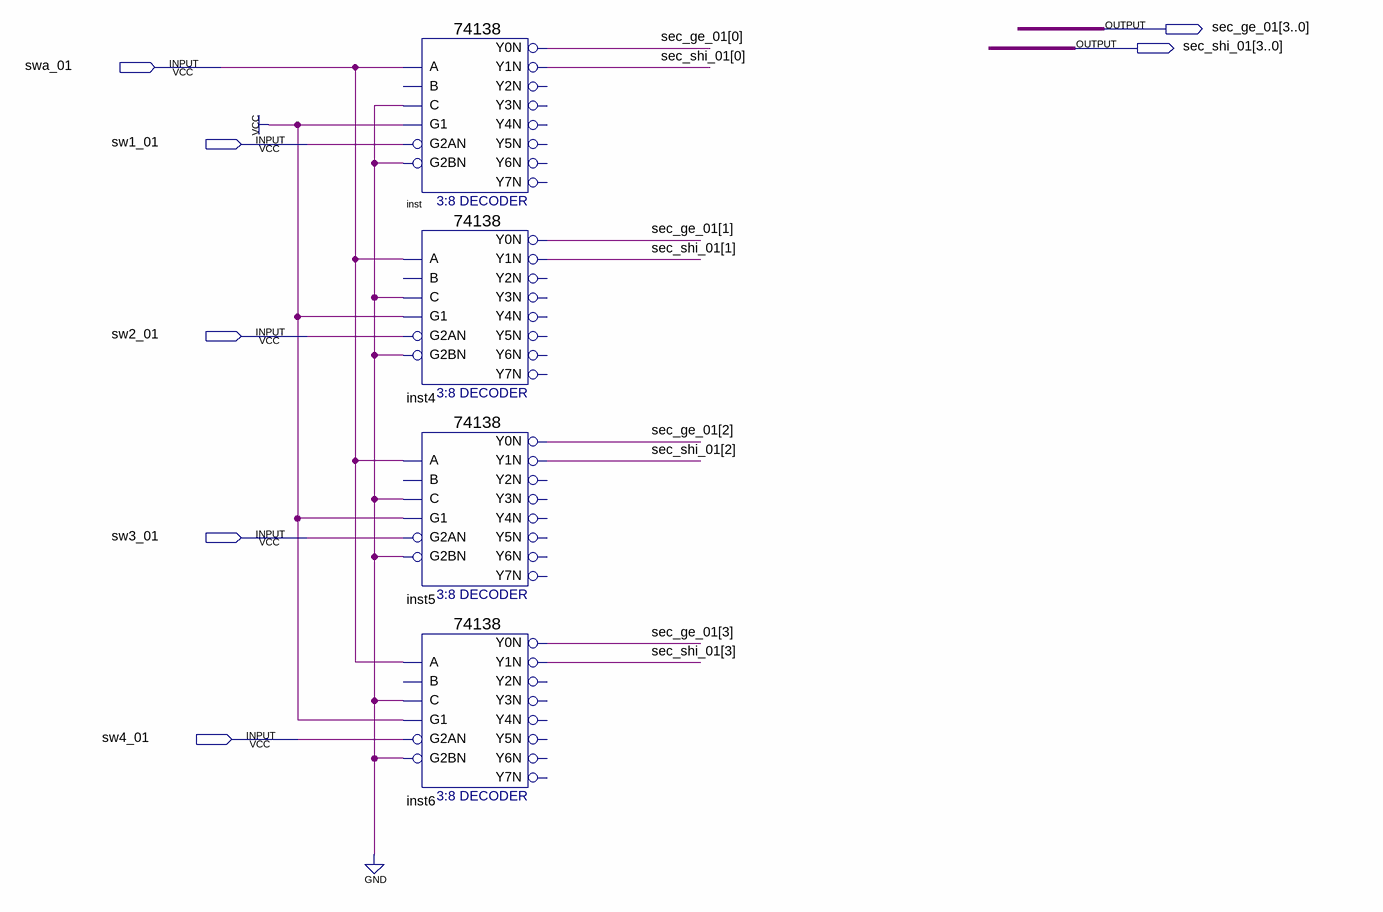
[diagram p0: schematic sheet]
// Quartus schematic fre_cin2.bdf as structural Verilog: 4 symbols, 7 pins
module fre_cin2 (
  input  swa_01,
  input  sw1_01,
  input  sw2_01,
  input  sw3_01,
  input  sw4_01,
  output [3:0] sec_ge_01,
  output [3:0] sec_shi_01
);

  \74138  inst (
    .A(swa_01), .G1(1'b1), .C(1'b0), .G2AN(sw1_01), .G2BN(1'b0), .Y0N(sec_ge_01[0]), .Y1N(sec_shi_01[0]));  // open: B, Y2N, Y3N, Y4N, Y5N, Y6N, Y7N
  \74138  inst4 (
    .A(swa_01), .G1(1'b1), .C(1'b0), .G2AN(sw2_01), .G2BN(1'b0), .Y0N(sec_ge_01[1]), .Y1N(sec_shi_01[1]));  // open: B, Y2N, Y3N, Y4N, Y5N, Y6N, Y7N
  \74138  inst5 (
    .A(swa_01), .G1(1'b1), .C(1'b0), .G2AN(sw3_01), .G2BN(1'b0), .Y0N(sec_ge_01[2]), .Y1N(sec_shi_01[2]));  // open: B, Y2N, Y3N, Y4N, Y5N, Y6N, Y7N
  \74138  inst6 (
    .A(swa_01), .G1(1'b1), .C(1'b0), .G2AN(sw4_01), .G2BN(1'b0), .Y0N(sec_ge_01[3]), .Y1N(sec_shi_01[3]));  // open: B, Y2N, Y3N, Y4N, Y5N, Y6N, Y7N
endmodule
